# Altium schematic sheet Block diagram.SchDoc
size A3; SheetNumber: 1; SheetTotal: 9
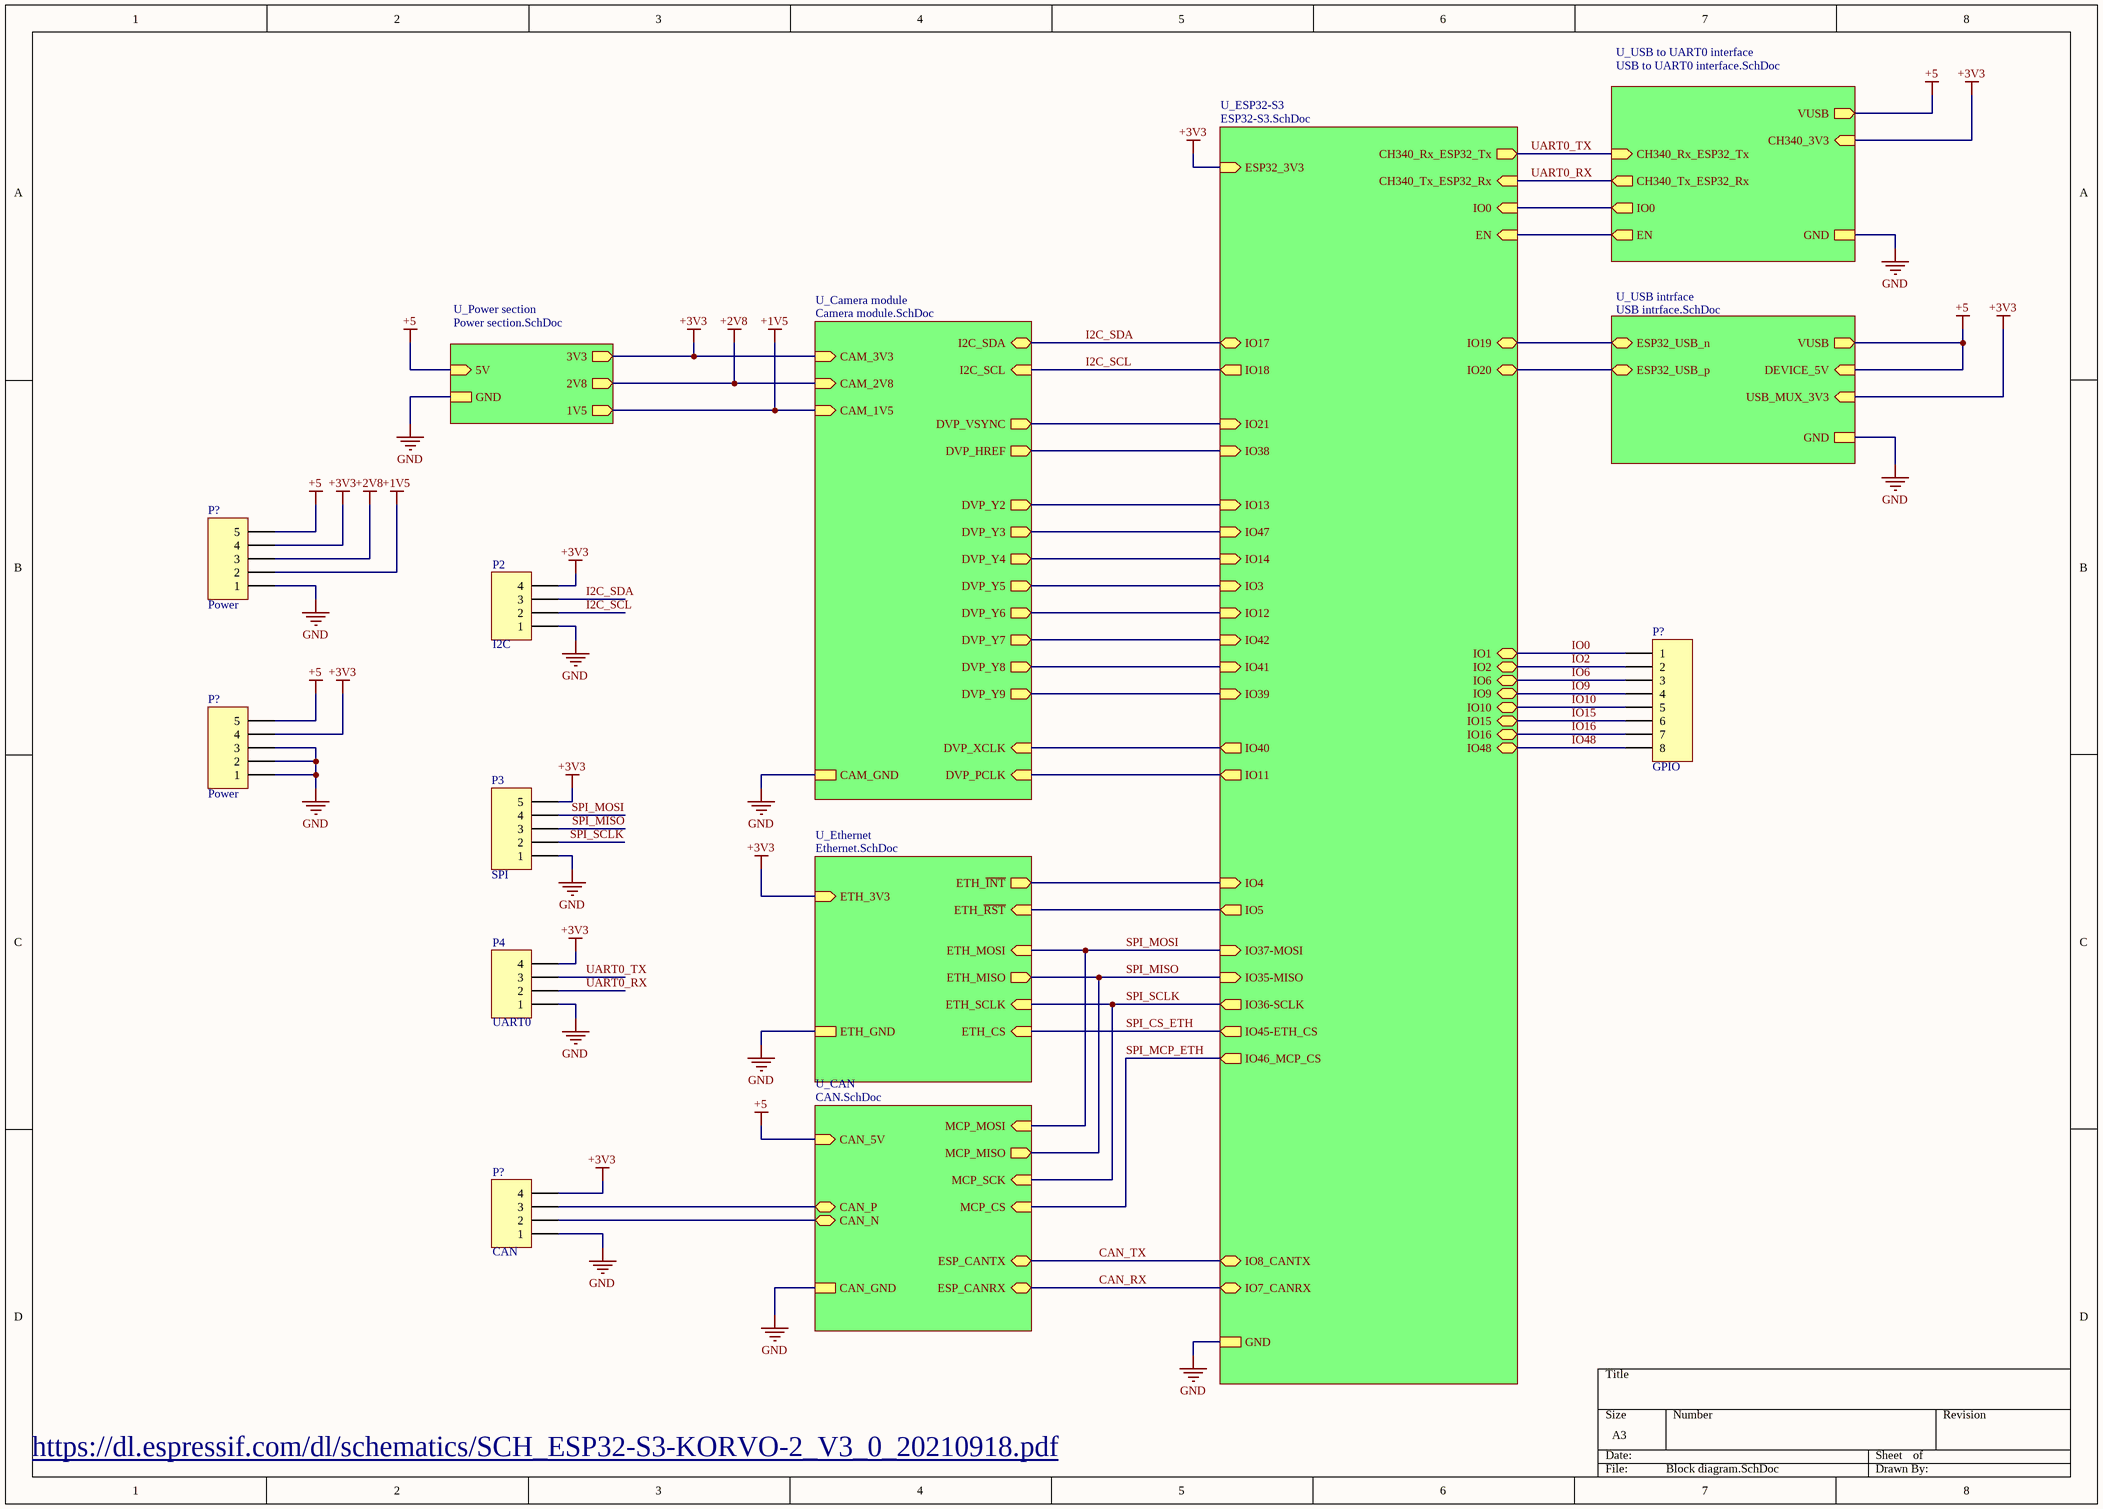
[diagram p0: Block diagram.SchDoc]

## Parts
(Parts that share a designator on the sheet are numbered #1, #2 ... from top to bottom, then left to right.)
P2  I2C  [Header 2.54X4]
P3  SPI  [Header 2.54X5]
P4  UART0  [Header 2.54X4]
P?#1  Power  [Header 2.54X5]
P?#2  GPIO  [Header 2.54X8]
P?#3  Power  [Header 2.54X5]
P?#4  CAN  [Header 2.54X4]

## Sub-sheets
U_Camera module = Camera module.SchDoc: I2C_SDA (bidir), I2C_SCL (in), DVP_VSYNC (out), DVP_HREF (out), DVP_Y9 (out), DVP_XCLK (in), DVP_Y8 (out), DVP_Y7 (out), DVP_PCLK (in), DVP_Y6 (out), DVP_Y2 (out), DVP_Y5 (out), DVP_Y3 (out), DVP_Y4 (out), CAM_2V8 (in), CAM_GND, CAM_1V5 (in), CAM_3V3 (in)
U_CAN = CAN.SchDoc: MCP_SCK (in), MCP_MOSI (in), MCP_MISO (out), MCP_CS (in), ESP_CANTX (bidir), ESP_CANRX (bidir), CAN_5V (in), CAN_GND, CAN_P (bidir), CAN_N (bidir)
U_ESP32-S3 = ESP32-S3.SchDoc: CH340_Tx_ESP32_Rx (in), CH340_Rx_ESP32_Tx (out), IO1 (bidir), IO2 (bidir), IO3 (in), IO4 (in), IO5 (out), IO6 (bidir), IO7_CANRX (bidir), IO8_CANTX (bidir), IO9 (bidir), IO10 (bidir), IO11 (out), IO12 (in), IO13 (in), IO14 (in), IO15 (bidir), IO16 (bidir), EN (in), IO17 (bidir), IO18 (out), IO19 (bidir), IO20 (bidir), IO21 (in), IO35-MISO (in), IO36-SCLK (out), IO37-MOSI (in), IO38 (in), IO39 (in), IO40 (out), IO41 (in), IO42 (in), IO45-ETH_CS (out), IO46_MCP_CS (out), IO47 (in), IO48 (bidir), IO0 (in), GND, ESP32_3V3 (in)
U_Ethernet = Ethernet.SchDoc: ETH_~{RST} (in), ETH_~{INT} (out), ETH_MOSI (in), ETH_MISO (out), ETH_SCLK (in), ETH_CS (in), ETH_3V3 (in), ETH_GND
U_Power section = Power section.SchDoc: 2V8 (out), GND, 1V5 (out), 3V3 (out), 5V (in)
U_USB intrface = USB intrface.SchDoc: ESP32_USB_n (bidir), ESP32_USB_p (bidir), VUSB (out), GND, USB_MUX_3V3 (in), DEVICE_5V (in)
U_USB to UART0 interface = USB to UART0 interface.SchDoc: CH340_Tx_ESP32_Rx (out), CH340_Rx_ESP32_Tx (in), EN (out), IO0 (out), VUSB (out), GND, CH340_3V3 (in)

## Nets
+1V5: P?#1.2 ; sheet U_Camera module/CAM_1V5, sheet U_Power section/1V5
+2V8: P?#1.3 ; sheet U_Camera module/CAM_2V8, sheet U_Power section/2V8
+3V3: P2.4 P3.5 P4.4 P?#1.4 P?#3.4 P?#4.4 ; sheet U_USB intrface/USB_MUX_3V3, sheet U_Camera module/CAM_3V3, sheet U_ESP32-S3/ESP32_3V3, sheet U_Power section/3V3, sheet U_Ethernet/ETH_3V3, sheet U_USB to UART0 interface/CH340_3V3
+5: P?#1.5 P?#3.5 ; sheet U_USB intrface/VUSB, sheet U_USB intrface/DEVICE_5V, sheet U_Power section/5V, sheet U_CAN/CAN_5V, sheet U_USB to UART0 interface/VUSB
GND: P2.1 P3.1 P4.1 P?#1.1 P?#3.1 P?#3.2 P?#3.3 P?#4.1 ; sheet U_USB intrface/GND, sheet U_Camera module/CAM_GND, sheet U_ESP32-S3/GND, sheet U_Power section/GND, sheet U_Ethernet/ETH_GND, sheet U_CAN/CAN_GND, sheet U_USB to UART0 interface/GND
CAN_RX: sheet U_ESP32-S3/IO7_CANRX, sheet U_CAN/ESP_CANRX
CAN_TX: sheet U_ESP32-S3/IO8_CANTX, sheet U_CAN/ESP_CANTX
I2C_SCL: P2.2 ; sheet U_Camera module/I2C_SCL, sheet U_ESP32-S3/IO18
I2C_SDA: P2.3 ; sheet U_Camera module/I2C_SDA, sheet U_ESP32-S3/IO17
IO0: P?#2.1 ; sheet U_ESP32-S3/IO1
IO2: P?#2.2 ; sheet U_ESP32-S3/IO2
IO6: P?#2.3 ; sheet U_ESP32-S3/IO6
IO9: P?#2.4 ; sheet U_ESP32-S3/IO9
IO10: P?#2.5 ; sheet U_ESP32-S3/IO10
IO15: P?#2.6 ; sheet U_ESP32-S3/IO15
IO16: P?#2.7 ; sheet U_ESP32-S3/IO16
IO48: P?#2.8 ; sheet U_ESP32-S3/IO48
SPI_CS_ETH: sheet U_ESP32-S3/IO45-ETH_CS, sheet U_Ethernet/ETH_CS
SPI_MCP_ETH: sheet U_ESP32-S3/IO46_MCP_CS, sheet U_CAN/MCP_CS
SPI_MISO: P3.3 ; sheet U_ESP32-S3/IO35-MISO, sheet U_Ethernet/ETH_MISO, sheet U_CAN/MCP_MISO
SPI_MOSI: P3.4 ; sheet U_ESP32-S3/IO37-MOSI, sheet U_Ethernet/ETH_MOSI, sheet U_CAN/MCP_MOSI
SPI_SCLK: P3.2 ; sheet U_ESP32-S3/IO36-SCLK, sheet U_Ethernet/ETH_SCLK, sheet U_CAN/MCP_SCK
UART0_RX: P4.2 ; sheet U_ESP32-S3/CH340_Tx_ESP32_Rx, sheet U_USB to UART0 interface/CH340_Tx_ESP32_Rx
UART0_TX: P4.3 ; sheet U_ESP32-S3/CH340_Rx_ESP32_Tx, sheet U_USB to UART0 interface/CH340_Rx_ESP32_Tx
NetP?#4_2: P?#4.2 ; sheet U_CAN/CAN_N
NetP?#4_3: P?#4.3 ; sheet U_CAN/CAN_P
(unnamed): sheet U_USB intrface/ESP32_USB_n, sheet U_ESP32-S3/IO19
(unnamed): sheet U_USB intrface/ESP32_USB_p, sheet U_ESP32-S3/IO20
(unnamed): sheet U_Camera module/DVP_VSYNC, sheet U_ESP32-S3/IO21
(unnamed): sheet U_Camera module/DVP_HREF, sheet U_ESP32-S3/IO38
(unnamed): sheet U_Camera module/DVP_Y9, sheet U_ESP32-S3/IO39
(unnamed): sheet U_Camera module/DVP_XCLK, sheet U_ESP32-S3/IO40
(unnamed): sheet U_Camera module/DVP_Y8, sheet U_ESP32-S3/IO41
(unnamed): sheet U_Camera module/DVP_Y7, sheet U_ESP32-S3/IO42
(unnamed): sheet U_Camera module/DVP_PCLK, sheet U_ESP32-S3/IO11
(unnamed): sheet U_Camera module/DVP_Y6, sheet U_ESP32-S3/IO12
(unnamed): sheet U_Camera module/DVP_Y2, sheet U_ESP32-S3/IO13
(unnamed): sheet U_Camera module/DVP_Y5, sheet U_ESP32-S3/IO3
(unnamed): sheet U_Camera module/DVP_Y3, sheet U_ESP32-S3/IO47
(unnamed): sheet U_Camera module/DVP_Y4, sheet U_ESP32-S3/IO14
(unnamed): sheet U_ESP32-S3/IO4, sheet U_Ethernet/ETH_~{INT}
(unnamed): sheet U_ESP32-S3/IO5, sheet U_Ethernet/ETH_~{RST}
(unnamed): sheet U_ESP32-S3/EN, sheet U_USB to UART0 interface/EN
(unnamed): sheet U_ESP32-S3/IO0, sheet U_USB to UART0 interface/IO0

## Notes on the sheet
- https://dl.espressif.com/dl/schematics/SCH_ESP32-S3-KORVO-2_V3_0_20210918.pdf

## Library data of the parts
P2 P4 P?#4 = Connector Pinheader 1x4: Header_4x1
P3 P?#1 P?#3 = Connector Pinheader 1x5: Header_5x1
P?#2 = Connector Pinheader 1x8: Header_8x1